# EAGLE design 7P-20700-BatteryPCB (EAGLE 9.6.1)
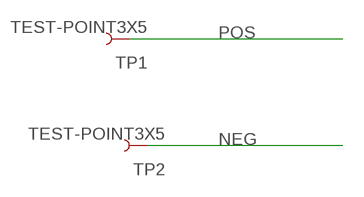
[diagram p0: schematic, sheet 1]

## Parts
TP1  TEST-POINT3X5  [PAD.03X.05]
TP2  TEST-POINT3X5  [PAD.03X.05]

## Nets
NEG: TP2.P$1
POS: TP1.P$1

## Library data of the parts
TP1 TP2 = SparkFun-Connectors:TEST-POINT: SparkFun Test Points Bare copper test points for troubleshooting or In-Circuit-Testing. These are used by our Production team for verifying production board runs using pogo-pins on test beds. SparkFun Products: SparkFun LSM9DS1 Breakout <https://www.sparkfun.com/products/13284> SparkFun PSOC <https://www.sparkfun.com/products/13714> SparkFun Load Cell Amplifier <https://www.sparkfun.com/products/13879>

## Board
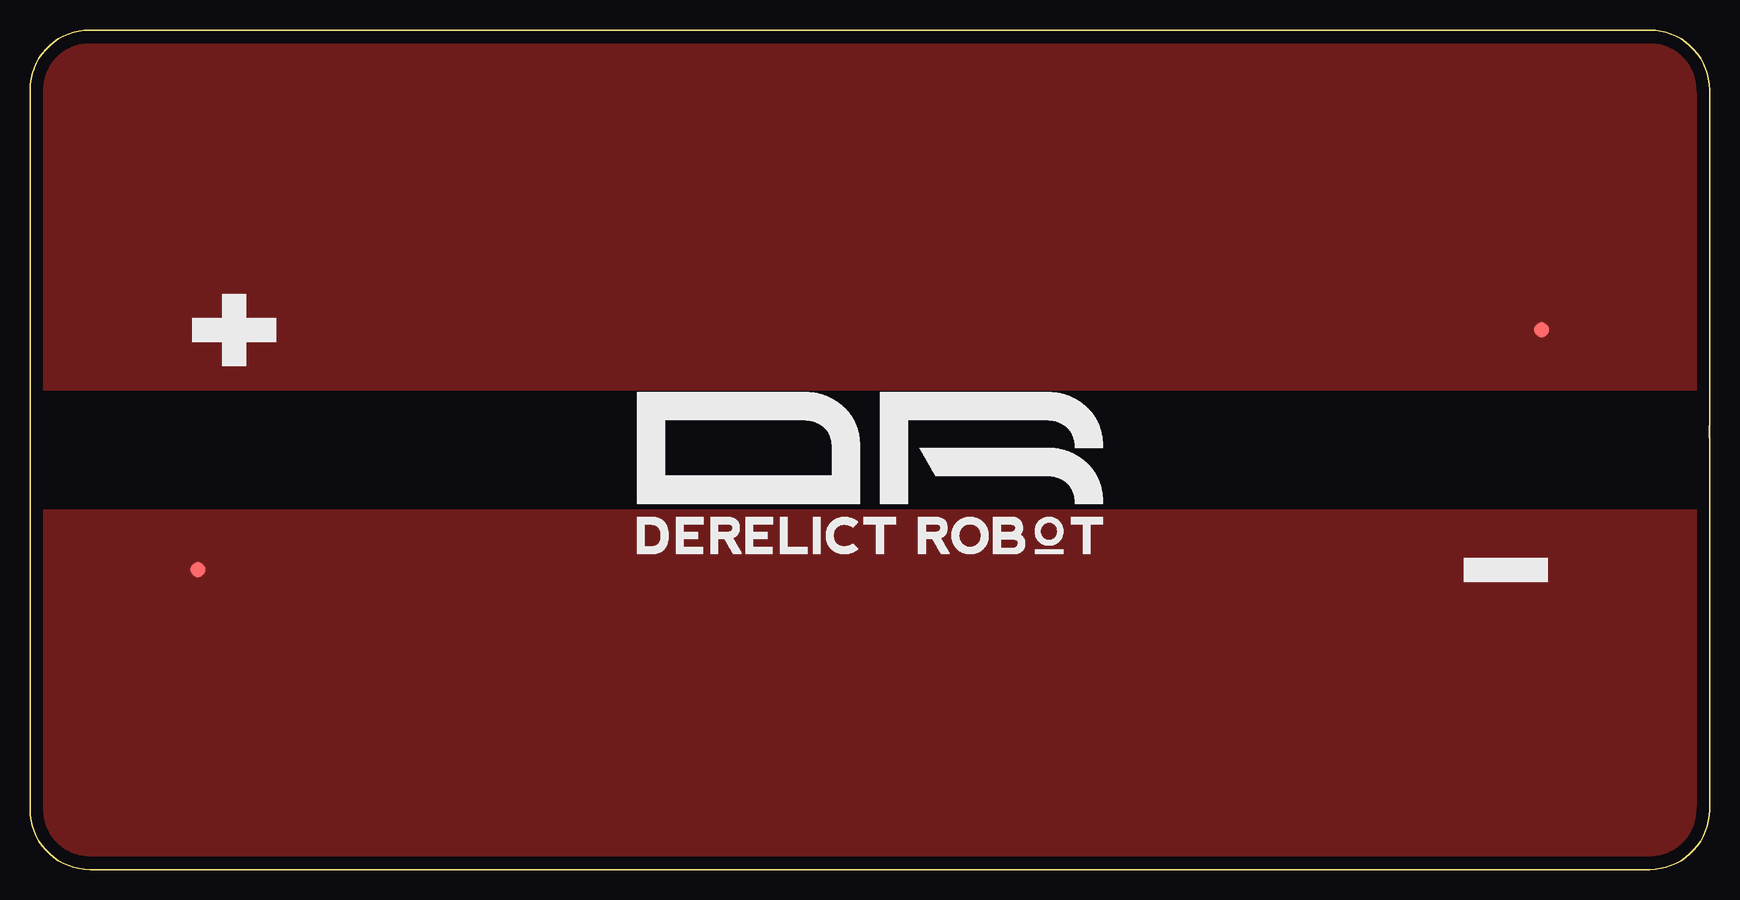
[diagram p1: board, top side]

Size 140 x 70 mm. Coordinates in mm from the lower left corner, seen from the top.
Outline: 140,65 140,5 arc-90 135,0 5,0 arc-90 0,5 0,65 arc-90 5,70 135,70 arc-90 140,65
Copper layers (1*16): Top 0.035mm / dielectric 1.5mm / Bottom 0.035mm
Design rules "default": minimum track width 6mil, minimum drill 0.35mm, track to track 6mil, track to pad 6mil, pad to pad 6mil, via to via 6mil, smd to smd 6mil, copper to edge 40mil, drill to drill 6mil, minimum pad ring 10mil, minimum via ring 8mil, stop-mask expansion 4mil, vias tented up to drill 0mil, thermal gap 10mil

### Footprints (pad centres in the part's own frame; a part is rotated, then mirrored left to right if it is on the bottom)
PAD.03X.05 = smd 1.27 x 1.27: P$1 0,0

### Placement (x,y rotation side)
TP1  126,45 180 top
TP2  14,25 0 top

### Tracks (layer width: path | path; a pad name or v marks a point on that pad's centre or on a via)
NEG
  pour Top (no thermals): 0,30 140,30 140,5 arc-90 135,0 5,0 arc-90 0,5
POS
  pour Top (no thermals): 140,40 140,65 arc90 135,70 5,70 arc90 0,65 0,40